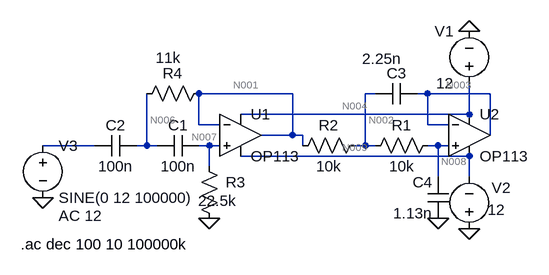
[diagram p0: schematic lab 4.asc]
lab 4.asc, the LTspice schematic file:
Version 4
SHEET 1 880 680
WIRE 192 96 48 96
WIRE 320 96 304 96
WIRE 400 96 384 96
WIRE 496 96 400 96
WIRE 464 128 464 80
WIRE 464 128 112 128
WIRE 48 144 48 96
WIRE 80 144 48 144
WIRE 400 144 400 96
WIRE 432 144 400 144
WIRE 192 160 192 96
WIRE 192 160 144 160
WIRE 208 160 192 160
WIRE 496 160 496 96
WIRE -112 176 -192 176
WIRE -32 176 -32 96
WIRE -32 176 -48 176
WIRE -16 176 -32 176
WIRE 64 176 48 176
WIRE 80 176 64 176
WIRE 208 176 208 160
WIRE 304 176 304 96
WIRE 304 176 288 176
WIRE 320 176 304 176
WIRE 416 176 400 176
WIRE 432 176 416 176
WIRE 464 192 112 192
WIRE 64 208 64 176
WIRE 416 224 416 176
WIRE 464 224 464 192
FLAG 64 288 0
FLAG 416 288 0
FLAG 464 304 0
FLAG 464 0 0
FLAG -192 256 0
SYMBOL OpAmps\\OP113 112 96 R0
SYMATTR InstName U1
SYMBOL OpAmps\\OP113 464 96 R0
SYMATTR InstName U2
SYMBOL cap 48 160 R90
WINDOW 0 0 32 VBottom 2
WINDOW 3 32 32 VTop 2
SYMATTR InstName C1
SYMATTR Value 100n
SYMBOL cap -48 160 R90
WINDOW 0 0 32 VBottom 2
WINDOW 3 32 32 VTop 2
SYMATTR InstName C2
SYMATTR Value 100n
SYMBOL cap 384 80 R90
WINDOW 0 0 32 VBottom 2
WINDOW 3 -53 54 VTop 2
SYMATTR InstName C3
SYMATTR Value 2.25n
SYMBOL cap 432 288 R180
WINDOW 0 24 56 Left 2
WINDOW 3 24 8 Left 2
SYMATTR InstName C4
SYMATTR Value 1.13n
SYMBOL res 416 160 R90
WINDOW 0 0 56 VBottom 2
WINDOW 3 32 56 VTop 2
SYMATTR InstName R1
SYMATTR Value 10k
SYMBOL res 304 160 R90
WINDOW 0 0 56 VBottom 2
WINDOW 3 32 56 VTop 2
SYMATTR InstName R2
SYMATTR Value 10k
SYMBOL res 80 304 R180
WINDOW 0 -40 72 Left 2
WINDOW 3 -26 43 Left 2
SYMATTR InstName R3
SYMATTR Value 22.5k
SYMBOL res -48 112 R270
WINDOW 0 32 56 VTop 2
WINDOW 3 87 49 VBottom 2
SYMATTR InstName R4
SYMATTR Value 11k
SYMBOL voltage 464 96 R180
WINDOW 0 24 96 Left 2
WINDOW 3 24 16 Left 2
WINDOW 123 0 0 Left 0
WINDOW 39 0 0 Left 0
SYMATTR InstName V1
SYMATTR Value 12
SYMBOL voltage 464 320 R180
WINDOW 0 -64 79 Left 2
WINDOW 3 -55 45 Left 2
WINDOW 123 0 0 Left 0
WINDOW 39 0 0 Left 0
SYMATTR InstName V2
SYMATTR Value 12
SYMBOL voltage -192 160 R0
WINDOW 123 24 124 Left 2
WINDOW 39 0 0 Left 0
SYMATTR InstName V3
SYMATTR Value SINE(0 12 100000)
SYMATTR Value2 AC 12
TEXT -226 328 Left 2 !.ac dec 100 10 100000k

The netlist it stands for:
* lab 4.asc
XU1 N007 N001 N004 N009 N001 OP113  ; pins In+ In- V+ V- OUT
XU2 N008 N003 N004 N009 N003 OP113  ; pins In+ In- V+ V- OUT
C1 N007 N006 100n
C2 N006 N005 100n
C3 N003 N002 2.25n
C4 0 N008 1.13n
R1 N008 N002 10k
R2 N002 N001 10k
R3 0 N007 22.5k
R4 N006 N001 11k
V1 N004 0 12
V2 0 N009 12
V3 N005 0 SINE(0 12 100000) AC 12
.ac dec 100 10 100000k
.lib ADI.lib
.backanno
.end

* Results of the author's LTspice run, read from the files saved beside the schematic
* Operating Point, zero values left out:
*   V(n009) = -12 V
*   V(n004) = 12 V
*   V(n001) = 5.933 mV
*   V(n007) = 5.958 mV
*   V(n003) = 11.2 mV
*   V(n008) = 11.23 mV
*   V(n006) = 5.933 mV
*   V(n002) = 8.581 mV
*   I(R1) = 264.8 nA
*   I(R2) = 264.8 nA
*   I(R3) = -264.8 nA
*   I(V1) = -3.171 mA
*   I(V2) = -3.17 mA
*   Ix(u1:3) = -264.8 nA
*   Ix(u1:2) = -214.8 nA
*   Ix(u1:7) = 1.585 mA
*   Ix(u1:4) = -1.585 mA
*   Ix(u1:6) = 479.6 nA
*   Ix(u2:3) = -264.8 nA
*   Ix(u2:2) = -214.8 nA
*   Ix(u2:7) = 1.585 mA
*   Ix(u2:4) = -1.585 mA
*   Ix(u2:6) = 214.8 nA
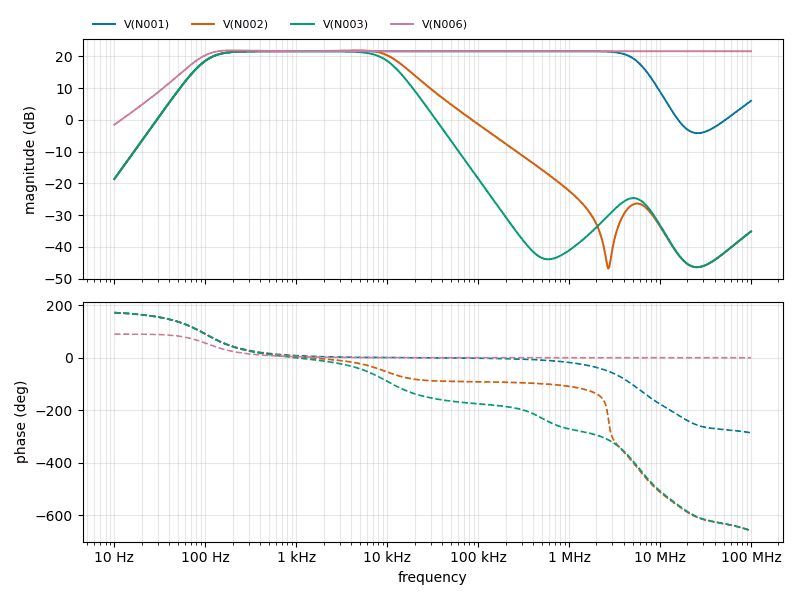
[diagram p1: AC Analysis of lab 4.asc, plotted from the saved traces]
* AC Analysis, 1 run:
*   V(N001): -18.62 dB at 10 Hz, 5.97 dB at 100 MHz, peak 21.59 dB at 1.148 MHz, 3 dB below the peak at 100.1 Hz and 5.496 MHz
*   V(N002): -18.62 dB at 10 Hz, -35.13 dB at 100 MHz, peak 21.83 dB at 4.786 kHz, 3 dB below the peak at 103 Hz and 12.3 kHz
*   V(N003): -18.62 dB at 10 Hz, -35.14 dB at 100 MHz, peak 21.59 dB at 660.7 Hz, 3 dB below the peak at 100.1 Hz and 9.954 kHz
*   V(N006): -1.54 dB at 10 Hz, 21.58 dB at 100 MHz, peak 21.87 dB at 199.5 Hz, 3 dB below the peak at 81.76 Hz